# EasyEDA Pro project DreamFly.eprj, schematic Schematic3
Board Name: Board3; Create Date: 2024-10-16; Page Name: DreamFly-OpticalFlow; Project Name: DreamFly; Schematic Name: Schematic3; Update Date: 2025-02-11; Company: 嘉立创EDA; Drawed: 梅雨; Page Size: A4; Version: V1.0
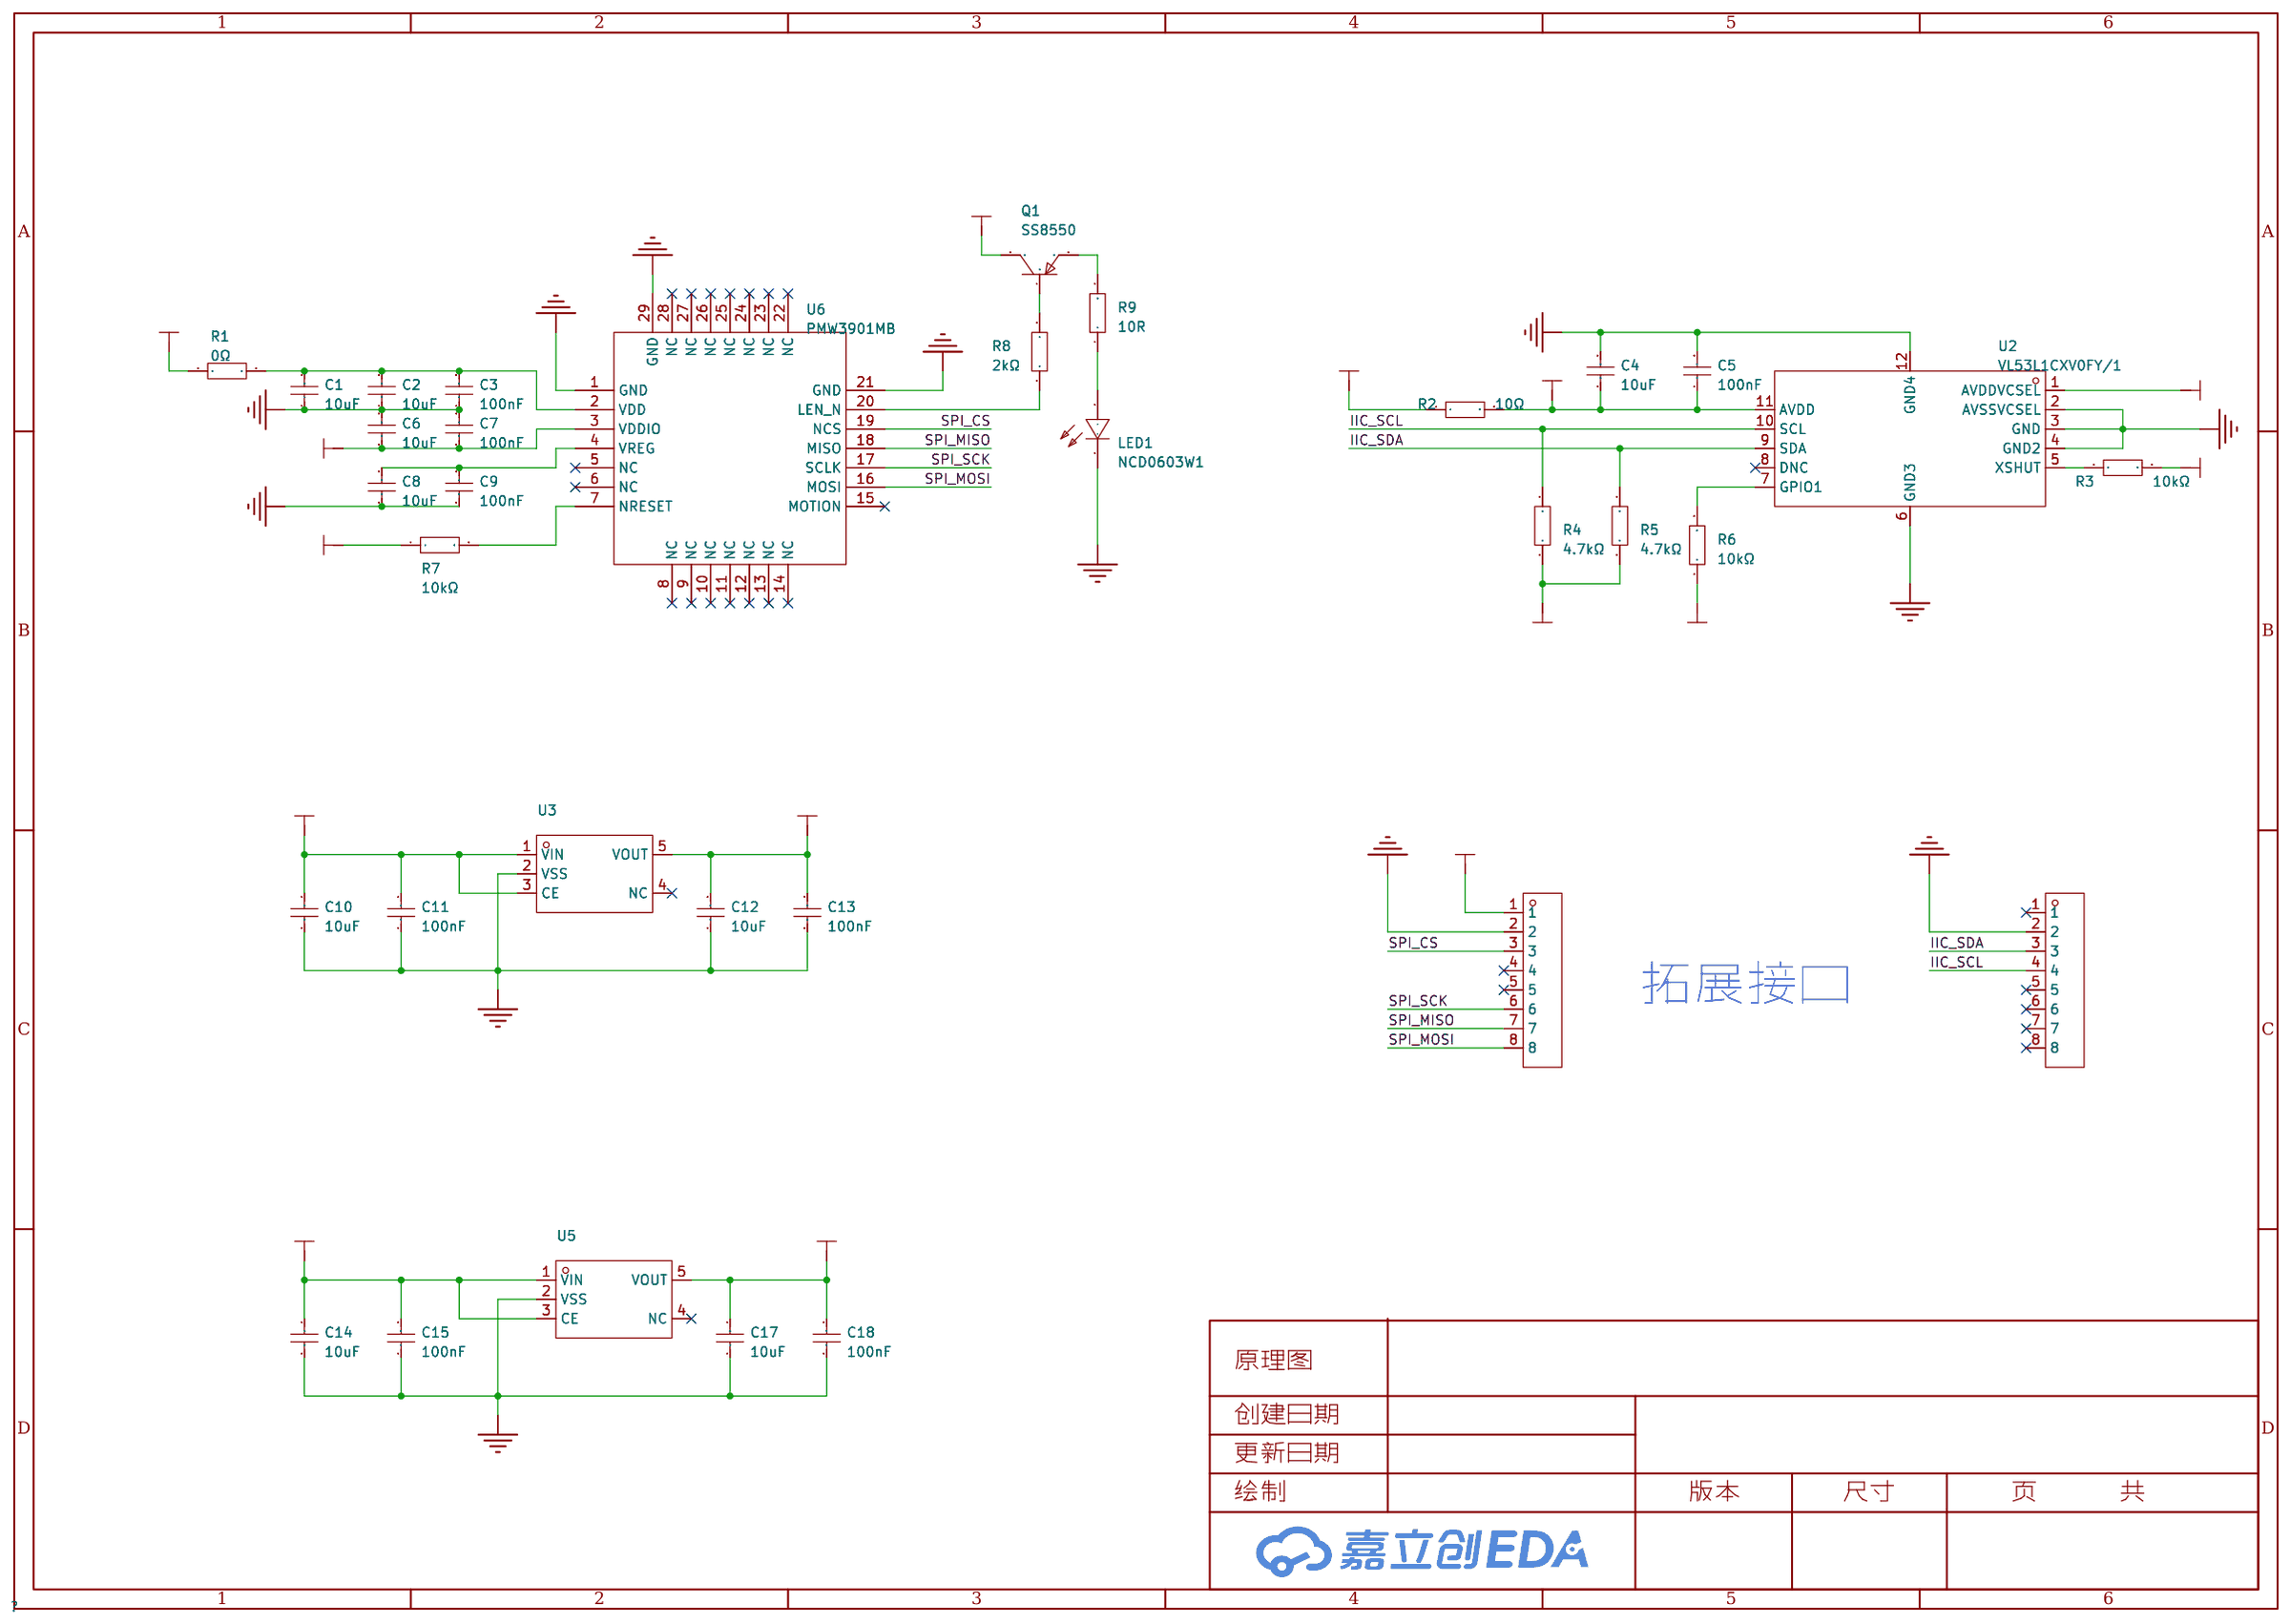
[diagram p2: schematic sheet]

## Parts
C1  10uF  [C0603]
C2  10uF  [C0603]
C3  100nF  [C0603]
C4  10uF  [C0603]
C5  100nF  [C0603]
C6  10uF  [C0603]
C7  100nF  [C0603]
C8  10uF  [C0603]
C9  100nF  [C0603]
C10  10uF  [C0603]
C11  100nF  [C0603]
C12  10uF  [C0603]
C13  100nF  [C0603]
C14  10uF  [C0603]
C15  100nF  [C0603]
C17  10uF  [C0603]
C18  100nF  [C0603]
LED1  NCD0603W1  [LED0603-RD]
P1  -  [header10-2.0mm]
P2  -  [header10-2.0mm]
Q1  SS8550  [SOT-23-3_L2.9-W1.3-P1.90-LS2.4-BR]
R1  0Ω  [R0603]
R2  10Ω  [R0603]
R3  10kΩ  [R0603]
R4  4.7kΩ  [R0603]
R5  4.7kΩ  [R0603]
R6  10kΩ  [R0603]
R7  10kΩ  [R0603]
R8  2kΩ  [R0603]
R9  10R  [R0603]
U2  VL53L1CXV0FY/1  [OPTO-SMD_VL53L1CXV0FY-1]
U3  XC6204B302MR  [SOT-23-5_L3.0-W1.7-P0.95-LS2.8-BL]
U5  XC6204B182MR  [SOT-23-5_L3.0-W1.5-P0.95-LS2.8-BL]
U6  PMW3901MB  [COB-28_L6.0-W6.0-P0.65-TL-EP]

## Library data of the parts
C1 C2 C4 C6 C8 C10 C12 C14 C17 = CL10A106KP8NNNC: 容值:10uF;精度:±10%;额定电压:10V;材质(温度系数):X5R;; LCSC Part Name: 10uF ±10% 10V; Supplier Part: C19702; Manufacturer: SAMSUNG(三星); Supplier Footprint: 0603; JLCPCB Part Class: Basic Part; Datasheet: https://atta.szlcsc.com/upload/public/pdf/source/20160218/1457707763339.pdf; Supplier: LCSC; Tolerance: ±10%; Voltage Rated: 10V; Temperature Coefficient: X5R
C3 C5 C7 C9 C11 C13 C15 C18 = CL10B104KB8NNNC: 容值:100nF;精度:±10%;额定电压:50V;材质(温度系数):X7R;; LCSC Part Name: 100nF ±10% 50V; Supplier Part: C1591; Manufacturer: SAMSUNG(三星); Supplier Footprint: 0603; JLCPCB Part Class: Extended Part; Datasheet: https://atta.szlcsc.com/upload/public/pdf/source/20160218/1457707763339.pdf; Supplier: LCSC; Tolerance: ±10%; Voltage Rated: 50V; Temperature Coefficient: X7R
LED1 = NCD0603W1: Supplier Part: C84265; Manufacturer: 国星光电; Supplier Footprint: 0603; JLCPCB Part Class: 扩展库; Datasheet: https://atta.szlcsc.com/upload/public/pdf/source/20200820/C84265_479E6193713348A548E5CD6D9278BF16.pdf; Supplier: LCSC; Emitted Color: 白色; Forward Voltage (VF): 2.6V~3.6V; Power Dissipation: 72mW; Forward Current: 5mA; Lens Color: 雾状黄透镜; Luminous Intensity: 200mcd~300mcd; Viewing Angle: 130°; Operating Temperature: -30℃~+85℃
P1 P2 = PM200V-11-08-H43: 插孔结构:1x8P;间距:2mm;行距:-;圆孔/方孔:方孔;安装类型:直插;排数:单排;总孔位数:8P;额定电流:2A;额定电压:-;插孔方向:顶部;塑高:4.3mm;工作温度范围:-40℃~+105℃;; LCSC Part Name: 间距:2mm 1x8P 直插; Supplier Footprint: 插件,P=2mm; JLCPCB Part Class: 扩展库; Datasheet: https://atta.szlcsc.com/upload/public/pdf/source/20201127/C962324_279235CD91B6BC5DCAC73F646CF096CF.pdf; Holes Structure: 1x8P; Pitch: 2mm; Circular Hole / Square Hole: 方孔; Mounting Type: 直插; Number of Rows: 单排; Number of Holes: 8P; Current Rating (Max): 2A; Holes Direction: 顶部; Insulation Height: 4.3mm; Operating Temperature Range: -40℃~+105℃
Q1 = SS8550 Y2(RANGE:200-350): LCSC Part Name: PNP 电流:1.5A 耐压:25V hfe=200~350; Supplier Part: C8542; Manufacturer: CJ(江苏长电/长晶); Supplier Footprint: SOT-23; JLCPCB Part Class: 基础库; Datasheet: https://atta.szlcsc.com/upload/public/pdf/source/20140809/1457707214734.pdf; Supplier: LCSC; Transistor Type: PNP; Collector Current (Ic): 1.5A; Collector-Emitter Breakdown Voltage (Vceo): 25V; Power Dissipation (Pd): 300mW; DC Current Gain (hFE@Ic,Vce): 200@100mA,1V; Transition Frequency (fT): 100MHz; Collector Cut-Off Current (Icbo): 100nA; Collector-Emitter Saturation Voltage (VCE(sat)@Ic,Ib): 500mV@800mA,80mA; Operating Temperature: -55℃~+150℃
R1 = 0603WAF0000T5E: 电阻类型:厚膜电阻;阻值:0Ω;精度:±1%;功率:100mW;最大工作电压:75V;; LCSC Part Name: 0Ω ±1% 100mW 厚膜电阻; Supplier Part: C21189; Manufacturer: UNI-ROYAL(厚声); Supplier Footprint: 0603; JLCPCB Part Class: Basic Part; Datasheet: https://atta.szlcsc.com/upload/public/pdf/source/20200306/C422600_1E6D84923E4A46A82E41ADD87F860B5C.pdf; Supplier: LCSC; Type: 厚膜电阻; Tolerance: ±1%; Power(Watts): 100mW; Overload Voltage (Max): 75V; Operating Temperature Range: -55℃~+155℃
R2 = 0603WAF100JT5E: 电阻类型:厚膜电阻;阻值:10Ω;精度:±1%;功率:100mW;最大工作电压:75V;温度系数:±400ppm/℃;; LCSC Part Name: 10Ω ±1% 100mW 厚膜电阻; Supplier Part: C22859; Manufacturer: UNI-ROYAL(厚声); Supplier Footprint: 0603; JLCPCB Part Class: Basic Part; Datasheet: https://atta.szlcsc.com/upload/public/pdf/source/20200306/C422600_1E6D84923E4A46A82E41ADD87F860B5C.pdf; Supplier: LCSC; Type: 厚膜电阻; Tolerance: ±1%; Power(Watts): 100mW; Overload Voltage (Max): 75V; Temperature Coefficient: ±400ppm/℃; Operating Temperature Range: -55℃~+155℃
R3 R6-R9 = 0603WAF1002T5E: 电阻类型:厚膜电阻;阻值:10kΩ;精度:±1%;功率:100mW;最大工作电压:75V;温度系数:±100ppm/℃;; LCSC Part Name: 厚膜电阻 10kΩ ±1% 100mW; Supplier Part: C25804; Manufacturer: UNI-ROYAL(厚声); Supplier Footprint: 0603; JLCPCB Part Class: Basic Part; Datasheet: https://atta.szlcsc.com/upload/public/pdf/source/20200306/C422600_1E6D84923E4A46A82E41ADD87F860B5C.pdf; Supplier: LCSC; Type: 厚膜电阻; Tolerance: ±1%; Power(Watts): 100mW; Overload Voltage (Max): 75V; Temperature Coefficient: ±100ppm/℃; Operating Temperature Range: -55℃~+155℃
R4 R5 = 0603WAF4701T5E: 电阻类型:厚膜电阻;阻值:4.7kΩ;精度:±1%;功率:100mW;最大工作电压:75V;温度系数:±100ppm/℃;; LCSC Part Name: 4.7kΩ ±1% 100mW 厚膜电阻; Supplier Part: C23162; Manufacturer: UNI-ROYAL(厚声); Supplier Footprint: 0603; JLCPCB Part Class: Basic Part; Datasheet: https://atta.szlcsc.com/upload/public/pdf/source/20200306/C422600_1E6D84923E4A46A82E41ADD87F860B5C.pdf; Supplier: LCSC; Type: 厚膜电阻; Tolerance: ±1%; Power(Watts): 100mW; Overload Voltage (Max): 75V; Temperature Coefficient: ±100ppm/℃; Operating Temperature Range: -55℃~+155℃
U2 = VL53L1CXV0FY/1: 线性范围:4m;; Supplier Part: C190004; Manufacturer: ST(意法半导体); Supplier Footprint: LGA-12(2.5x4.9); JLCPCB Part Class: 扩展库; Datasheet: https://atta.szlcsc.com/upload/public/pdf/source/20180403/C190004_0741FA17F5A8F41A8273E0771692B843.pdf; Supplier: LCSC; Supply Voltage: 2.6V~3.5V; Iinearity Range: 4m
U3 = XC6204B302MR: Supplier Part: C18212678; Manufacturer: TECH PUBLIC(台舟); Supplier Footprint: SOT-23-5; Datasheet: https://atta.szlcsc.com/upload/public/pdf/source/20231024/3932E471DEDBF94F2F854F1C0B7D03E0.pdf; Supplier: LCSC
U5 = XC6204B182MR: Supplier Part: C18212674; Manufacturer: TECH PUBLIC(台舟); Supplier Footprint: SOT-23-5; Datasheet: https://atta.szlcsc.com/upload/public/pdf/source/20231024/3425846FD192C46A27B59A449BA4E751.pdf; Supplier: LCSC
U6 = PMW3901MB-TXQT: Supplier Part: C9900000235; Supplier Footprint: COB-28_6.0X6.0X0.65P; JLCPCB Part Class: 扩展库; Supplier: LCSC

## Nets
1V8: C17.2 C18.2 R1.1 U5.5(VOUT)
2V8: C4.1 C5.1 R2.2 R4.2 R5.2 U2.1(AVDDVCSEL) U2.11(AVDD)
3V3: C6.1 C7.1 C12.2 C13.2 C14.2 C15.2 Q1.3(C) R2.1 R3.2 R6.1 R7.1 U3.5(VOUT) U5.1(VIN) U5.3(CE) U6.3(VDDIO)
GND: C1.1 C2.1 C3.1 C4.2 C5.2 C6.2 C7.2 C8.1 C9.1 C10.1 C11.1 C12.1 C13.1 C14.1 C15.1 C17.1 C18.1 LED1.1(-) P1.2 P2.2 U2.2(AVSSVCSEL) U2.3(GND) U2.4(GND2) U2.6(GND3) U2.12(GND4) U3.2(VSS) U5.2(VSS) U6.1(GND) U6.21(GND) U6.29(GND)
VBAT: C10.2 C11.2 P1.1 U3.1(VIN) U3.3(CE)
IIC_SCL: P2.4 R4.1 U2.10(SCL)
IIC_SDA: P2.3 R5.1 U2.9(SDA)
SPI_CS: P1.3 U6.19(NCS)
SPI_MISO: P1.7 U6.18(MISO)
SPI_MOSI: P1.8 U6.16(MOSI)
SPI_SCK: P1.6 U6.17(SCLK)
$1N1936: C1.2 C2.2 C3.2 R1.2 U6.2(VDD)
$1N1938: R7.2 U6.7(NRESET)
$1N1942: C8.2 C9.2 U6.4(VREG)
$1N1955: R3.1 U2.5(XSHUT)
$1N1962: R6.2 U2.7(GPIO1)
$1N9336: Q1.1(B) R8.2
$1N9340: Q1.2(E) R9.2
$1N9345: R8.1 U6.20(LEN_N)
$1N9350: LED1.2(+) R9.1

Not connected (* = marked no-connect by the designer): P1 4* 5*; P2 1* 5* 6* 7* 8*; U2 8(DNC)*; U3 4(NC)*; U5 4(NC)*; U6 5(NC)* 6(NC)* 8(NC)* 9(NC)* 10(NC)* 11(NC)* 12(NC)* 13(NC)* 14(NC)* 15(MOTION)* 22(NC)* 23(NC)* 24(NC)* 25(NC)* 26(NC)* 27(NC)* 28(NC)*

## Notes on the sheet
- 拓展接口
